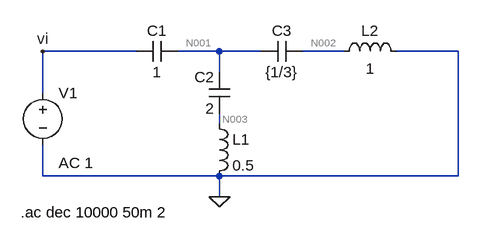
[diagram p0: schematic ej1.asc]
ej1.asc, the LTspice schematic file:
Version 4
SHEET 1 880 680
WIRE -240 160 -384 160
WIRE -112 160 -176 160
WIRE -48 160 -112 160
WIRE 80 160 16 160
WIRE 256 160 160 160
WIRE -112 192 -112 160
WIRE -384 224 -384 160
WIRE -112 272 -112 256
WIRE -384 352 -384 304
WIRE -112 352 -384 352
WIRE 256 352 256 160
WIRE 256 352 -112 352
WIRE -112 384 -112 352
FLAG -112 384 0
FLAG -384 160 vi
SYMBOL cap -176 144 R90
WINDOW 0 0 32 VBottom 2
WINDOW 3 32 32 VTop 2
SYMATTR InstName C1
SYMATTR Value 1
SYMBOL cap -96 256 R180
WINDOW 0 24 56 Left 2
WINDOW 3 24 8 Left 2
SYMATTR InstName C2
SYMATTR Value 2
SYMBOL ind -128 256 R0
SYMATTR InstName L1
SYMATTR Value 0.5
SYMBOL cap 16 144 R90
WINDOW 0 0 32 VBottom 2
WINDOW 3 32 32 VTop 2
SYMATTR InstName C3
SYMATTR Value {1/3}
SYMBOL ind 64 176 R270
WINDOW 0 32 56 VTop 2
WINDOW 3 5 56 VBottom 2
SYMATTR InstName L2
SYMATTR Value 1
SYMBOL voltage -384 208 R0
WINDOW 123 24 124 Left 2
WINDOW 39 0 0 Left 0
SYMATTR InstName V1
SYMATTR Value ""
SYMATTR Value2 AC 1
TEXT -418 408 Left 2 !.ac dec 10000 50m 2

The netlist it stands for:
* ej1.asc
C1 N001 vi 1
C2 N003 N001 2
L1 N003 0 0.5
C3 N002 N001 {1/3}
L2 N002 0 1
V1 vi 0 AC 1
.ac dec 10000 50m 2
.backanno
.end

* Results of the author's LTspice run, read from the files saved beside the schematic
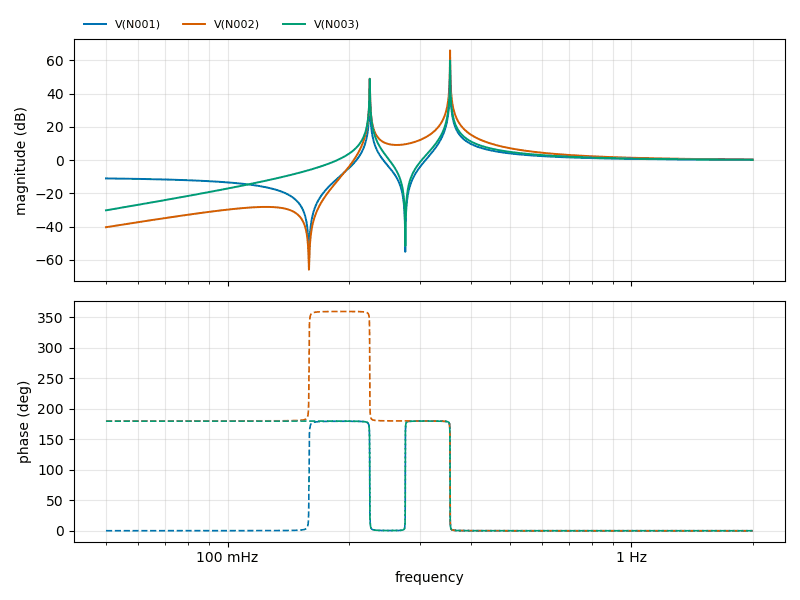
[diagram p1: AC Analysis of ej1.asc, plotted from the saved traces]
* AC Analysis, 1 run:
*   V(N001): -11.04 dB at 50 mHz, 0.17 dB at 2 Hz, peak 58.72 dB at 355.9 mHz, 3 dB below the peak at 355.8 mHz and 356 mHz
*   V(N002): -40.40 dB at 50 mHz, 0.34 dB at 2 Hz, peak 66.68 dB at 355.9 mHz, 3 dB below the peak at 355.8 mHz and 356 mHz
*   V(N003): -30.25 dB at 50 mHz, 0.22 dB at 2 Hz, peak 60.66 dB at 355.9 mHz, 3 dB below the peak at 355.8 mHz and 356 mHz